# EAGLE design 233_9axis (EAGLE 9.6.2)
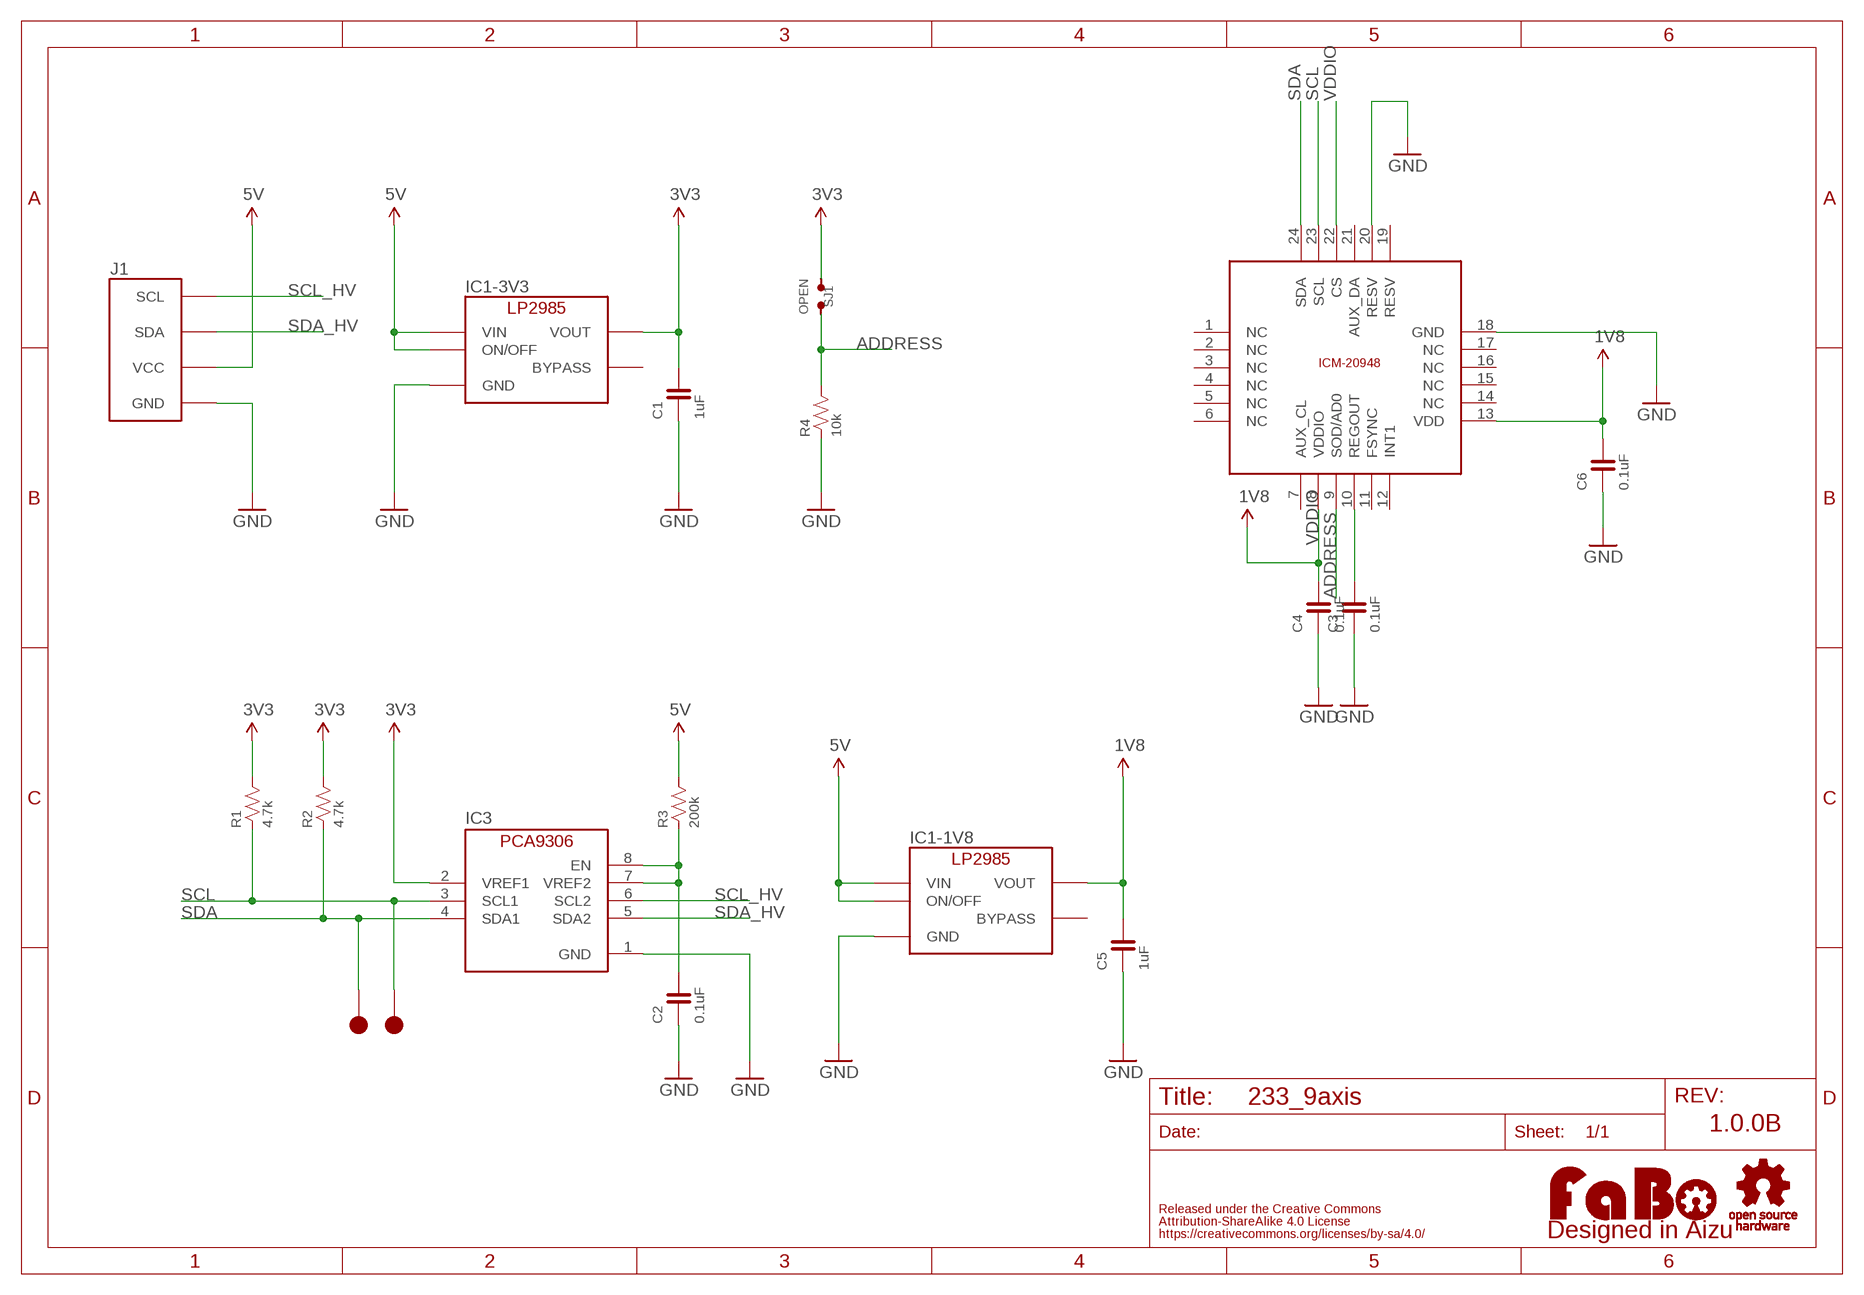
[diagram p0: schematic, sheet 1]

## Parts
C1  1uF  CAPACITOR-0603  [0603]
C2  0.1uF  CAPACITOR-0603  [0603]
C3  0.1uF  CAPACITOR-0603  [0603]
C4  0.1uF  CAPACITOR-0603  [0603]
C5  1uF  CAPACITOR-0603  [0603]
C6  0.1uF  CAPACITOR-0603  [0603]
IC1-1V8  IC1-1V8  LP2985-33DBV  [SOT-23-5]
IC1-3V3  IC1-1V8  LP2985-33DBV  [SOT-23-5]
IC3  PCA9306GM  [XQFN8]
ICM-20948  TDK-ICM20948  [TDK-ICM20948]
J1  FABO_BRICK_I2C  [FABO_BRICK_I2C]
LOGO1  LOGO_FABO-M  [LOGO_FABO_M]
R1  4.7k  RESISTOR-0603  [0603]
R2  4.7k  RESISTOR-0603  [0603]
R3  200k  RESISTOR-0603  [0603]
R4  10k  RESISTOR-0603  [0603]
SJ1  OPEN  SMD-JUMPER-2-OPEN  [SMD-JUMPER-2-OPEN]
TP1  TP-15  [TP-15]
TP2  TP-15  [TP-15]
U$2  LOGO_OSHW-M_BOTTOM  [LOGO_OSHW_M_BOTTOM]

## Nets
1V8: C5.2 C6.2 IC1-1V8.5(VOUT) ICM-20948.13(VDD)
3V3: C1.2 IC1-3V3.5(VOUT) IC3.2(VREF1) R1.2 R2.2 SJ1.1
5V: IC1-1V8.1(VIN) IC1-1V8.3(ON/OFF) IC1-3V3.1(VIN) IC1-3V3.3(ON/OFF) J1.VCC R3.2
ADDRESS: ICM-20948.9(SOD/AD0) R4.2 SJ1.2
GND: C1.1 C2.1 C3.1 C4.1 C5.1 C6.1 IC1-1V8.2(GND) IC1-3V3.2(GND) IC3.1(GND) ICM-20948.18(GND) ICM-20948.20(RESV) J1.GND R4.1
N$1: C2.2 IC3.7(VREF2) IC3.8(EN) R3.1
N$3: C3.2 ICM-20948.10(REGOUT)
SCL: IC3.3(SCL1) ICM-20948.23(SCL) R1.1 TP2.1
SCL_HV: IC3.6(SCL2) J1.SCL
SDA: IC3.4(SDA1) ICM-20948.24(SDA) R2.1 TP1.1
SDA_HV: IC3.5(SDA2) J1.SDA
VDDIO: C4.2 ICM-20948.8(VDDIO) ICM-20948.22(CS) ; supply symbol labelled 1V8
Unconnected: IC1-1V8.4(BYPASS) IC1-3V3.4(BYPASS) ICM-20948.1(NC) ICM-20948.2(NC) ICM-20948.3(NC) ICM-20948.4(NC) ICM-20948.5(NC) ICM-20948.6(NC) ICM-20948.7(AUX_CL) ICM-20948.11(FSYNC) ICM-20948.12(INT1) ICM-20948.14(NC) ICM-20948.15(NC) ICM-20948.16(NC) ICM-20948.17(NC) ICM-20948.19(RESV) ICM-20948.21(AUX_DA)

## Notes on the sheet
- 1.0.0B

## Library data of the parts
C1-C6 = FaBo-Capacitor:CAPACITOR: CAPACITOR
IC1-1V8 IC1-3V3 = FaBo-Supply:LP2985: LP2985
IC3 = FaBo-LevelTranslator:PCA9306
ICM-20948 = FaBo-Axis:TDK-ICM20948
J1 = FaBo-Template:FABO_BRICK_I2C: FaBo Brick I2C
LOGO1 = component:LOGO_FABO
R1-R4 = FaBo-Resistors:RESISTOR: RESISTOR
SJ1 = FaBo-Supply:SMD-JUMPER-2
TP1 TP2 = FaBo-Supply:TP
U$2 = FaBo-etc:LOGO_OSHW

## Board
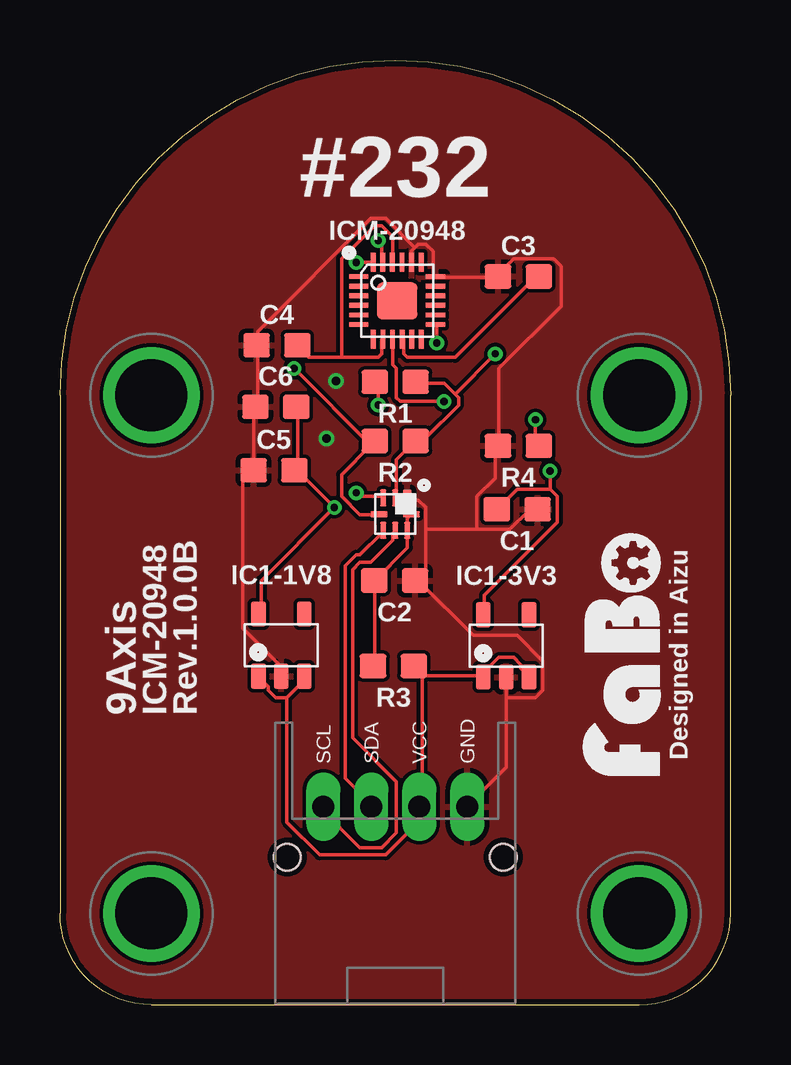
[diagram p1: board, top side]
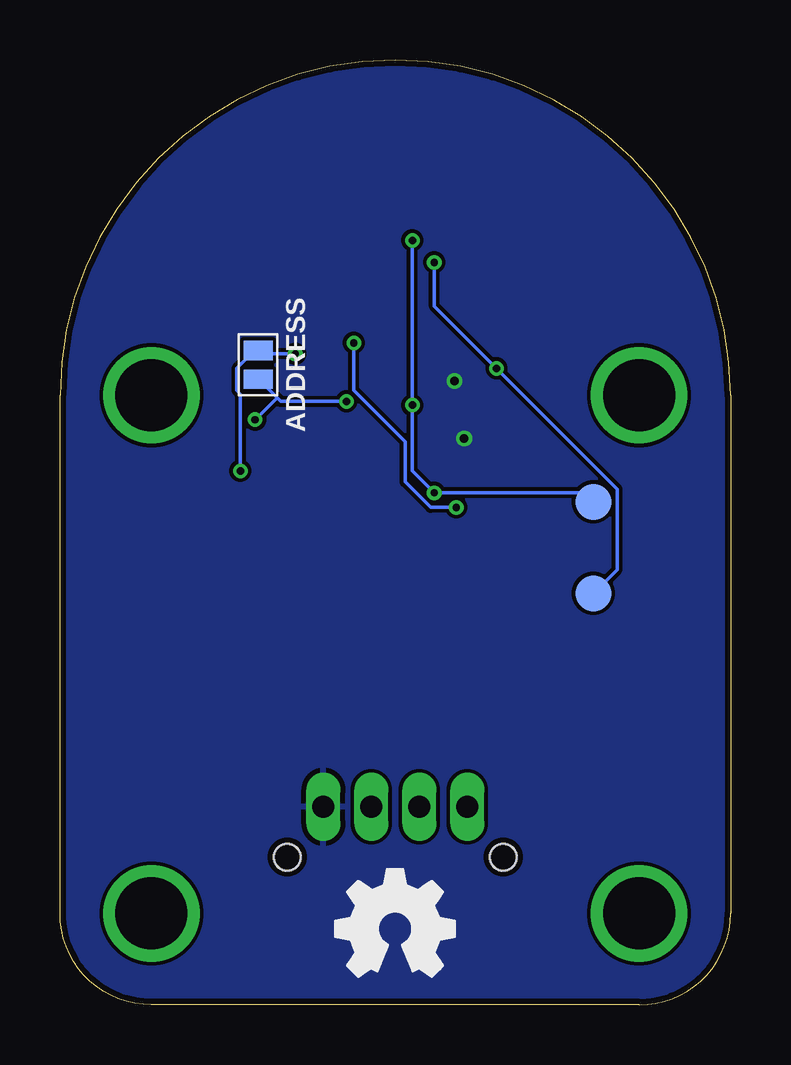
[diagram p2: board, bottom side, seen from below]

Size 27.94 x 39.37 mm. Coordinates in mm from the lower left corner, seen from the top.
Copper layers (1*16): Top 0.035mm / dielectric 1.6mm / Bottom 0.035mm
Design rules "PCBway": minimum track width 6mil, minimum drill 12mil, track to track 6mil, track to pad 6mil, pad to pad 6mil, via to via 6mil, smd to smd 6mil, copper to edge 10mil, drill to drill 10mil, minimum pad ring 10mil, minimum via ring 6mil, stop-mask expansion 2mil, vias tented up to drill 100mil, thermal gap 8mil

### Footprints (pad centres in the part's own frame; a part is rotated, then mirrored left to right if it is on the bottom)
0603 = smd 1.1 x 1: 1 -0.85,0; 2 0.85,0
SOT-23-5 = smd 0.6 x 1.05: 1 -0.95,-1.3; 2 0,-1.3; 3 0.95,-1.3; 4 0.95,1.3; 5 -0.95,1.3
XQFN8 = smd 0.7 x 0.35: 1 -0.675,0.5 | smd 0.7 x 0.25: 2 -0.675,0; 3 -0.675,-0.5; 5 0.675,-0.5; 6 0.675,0; 7 0.675,0.5 | smd 0.25 x 0.7: 4 0,-0.675; 8 0,0.675
TDK-ICM20948 = smd 0.8 x 0.2: 1 -1.6,1.01; 2 -1.6,0.61; 3 -1.6,0.21; 4 -1.6,-0.19; 5 -1.6,-0.59; 6 -1.6,-0.99; 13 1.6,-0.99; 14 1.6,-0.59; 15 1.6,-0.19; 16 1.6,0.21; 17 1.6,0.61; 18 1.6,1.01 | smd 0.2 x 0.8: 7 -0.99,-1.6; 8 -0.59,-1.6; 9 -0.19,-1.6; 10 0.21,-1.6; 11 0.61,-1.6; 12 1.01,-1.6; 19 1,1.6; 20 0.6,1.6; 21 0.2,1.6; 22 -0.2,1.6; 23 -0.6,1.6; 24 -1,1.6 | smd 1.7 x 1.55: 25 0,0
FABO_BRICK_I2C = drill 0.9 pad 1.422 long: GND 3,-10.795; SCL -3,-10.795; SDA -1,-10.795; VCC 1,-10.795 | drill 3 pad 3.81: P$1 -10.16,6.35; P$2 10.16,6.35; P$3 -10.16,-15.24; P$4 10.16,-15.24 | hole 1.1: -4.5,-12.895; 4.5,-12.895
SMD-JUMPER-2-OPEN = smd 0.8 x 1.2: 1 -0.6,0; 2 0.6,0
TP-15 = smd 1.5 x 1.5: 1 0,0

### Placement (x,y rotation side)
C1  19.05,20.65 180 top
C2  13.94,17.68 180 top
C3  19.1,30.35 0 top
C4  9.04,27.48 0 top
C5  8.92,22.28 0 top
C6  8.99,24.92 0 top
IC1-1V8  9.22,14.99 0 top
IC1-3V3  18.59,14.96 0 top
IC3  13.97,20.45 270 top
ICM-20948  14.05,29.34 0 top
J1  13.97,19.05 0 top
LOGO1  25.4,14.61 90 top
R1  13.97,25.96 0 top
R2  13.97,23.5 0 top
R3  13.89,14.12 0 top
R4  19.1,23.29 0 top
SJ1  19.68,26.67 270 bottom
TP1  5.71,17.14 0 bottom
TP2  5.71,20.95 0 bottom
U$2  13.97,3.17 0 top

### Tracks (layer width: path | path; a pad name or v marks a point on that pad's centre or on a via)
1V8  (via drill 0.3)
  Top 0.152: v15.7,27.58 15.7,28.35 ICM-20948.13 | IC1-1V8.5 8.38,16.31 8.38,17.68 v11.43,20.73 9.91,22.25 C5.2 9.91,22.4 9.91,24.84 C6.2
  Bottom 0.152: v15.7,27.58 15.7,25.6 13.56,23.47 13.56,21.79 12.5,20.73 v11.43,20.73
3V3  (via drill 0.3)
  Top 0.152: 20.42,21.49 20.73,21.18 20.73,20.12 17.68,17.07 17.68,16.31 IC1-3V3.5 | 20.42,21.49 19.05,21.49 18.29,20.73 C1.2 | IC3.2 14.02,21.18 14.02,22.71 14.78,23.47 R2.2 14.94,23.62 15.24,23.62 16.61,24.99 16.61,25.3 16.46,25.45 | 16.46,25.45 16,25.91 14.94,25.91 R1.2 | 16.46,25.45 v18.14,27.13 | v20.42,22.25 20.42,21.49
  Bottom 0.152: v18.14,27.13 19.66,27.13 SJ1.1 19.81,27.28 20.57,26.52 20.57,25.6 20.42,25.45 v20.42,22.25
5V
  Top 0.152: 15.09,13.72 17.53,13.72 | 15.09,13.72 14.78,14.02 R3.2 15.09,13.72 | 17.53,13.72 18.29,14.48 18.9,14.48 19.2,14.17 19.2,14.02 19.51,13.72 IC1-3V3.3 | 17.53,13.72 IC1-3V3.1 | 9.45,12.8 8.99,12.8 8.69,13.11 8.69,13.26 8.38,13.56 IC1-1V8.1 | 9.45,12.8 10.21,13.56 IC1-1V8.3 | 9.45,12.8 9.45,7.62 10.82,6.25 13.56,6.25 14.94,7.62 14.94,8.23 J1.VCC 15.09,8.38 15.09,13.72
ADDRESS  (via drill 0.3)
  Top 0.152: v16,25.15 14.17,25.15 14.02,25.3 14.02,26.52 13.87,26.67 ICM-20948.9 | v19.81,24.38 19.81,23.32 R4.2
  Bottom 0.152: v16,25.15 18.75,25.15 18.9,25.3 | 18.9,25.3 19.66,26.06 SJ1.2 | 18.9,25.3 v19.81,24.38
GND  (via drill 0.35)
  Top 0.152: 18.59,12.8 18.59,9.91 17.07,8.38 J1.GND | 18.59,12.8 IC1-3V3.2 | 15.24,19.81 15.24,17.98 14.94,17.68 | 15.24,19.81 15.24,20.73 14.94,21.03 14.48,21.03 IC3.1 | 15.24,19.81 17.37,19.81 | 17.37,19.81 18.75,19.81 19.51,20.57 19.81,20.57 C1.1 | 17.37,19.81 17.37,21.18 18.14,21.95 18.14,23.16 R4.1 18.29,23.32 18.29,26.52 20.88,29.11 20.88,30.79 20.57,31.09 18.9,31.09 18.29,30.48 C3.1 18.14,30.33 15.7,30.33 ICM-20948.18 15.54,30.33 15.54,31.39 15.24,31.7 14.94,31.7 14.78,31.55 | 18.59,12.8 19.81,12.8 20.12,13.11 20.12,14.33 19.05,15.39 17.22,15.39 14.94,17.68 | 14.94,17.68 C2.1 | 14.78,31.55 14.63,31.39 14.63,30.94 ICM-20948.20 | IC1-1V8.2 9.14,13.72 9.14,14.17 7.62,15.7 7.62,21.95 7.92,22.25 C5.1 8.08,22.4 8.08,24.84 C6.1 8.23,24.99 8.23,27.43 C4.1 8.23,27.58 8.23,28.04 12.95,32.77 13.56,32.77 14.78,31.55
  other vias: 11.5,26 11.1,23.6
  pour Top: 0,0 27.94,0 27.94,39.37 0,39.37
  pour Bottom: 0,0 27.94,0 27.94,39.37 0,39.37
N$1
  Top 0.152: IC3.8 14.63,20.42 14.48,20.27 14.48,19.81 IC3.7 14.48,19.66 14.48,19.05 13.11,17.68 | 13.11,17.68 13.11,14.17 R3.1 | 13.11,17.68 C2.2
N$3
  Top 0.152: ICM-20948.10 14.33,27.74 14.33,27.13 14.48,26.98 16.46,26.98 19.81,30.33 C3.2
SCL  (via drill 0.3)
  Top 0.152: v12.34,21.34 12.5,21.18 13.41,21.18 IC3.3 | v13.26,31.85 13.41,31.7 13.41,30.94 ICM-20948.23 | v13.26,24.99 13.26,25.91 R1.1
  Bottom 0.152: TP2.1 6.1,21.34 v12.34,21.34 13.26,22.25 v13.26,24.99 v13.26,31.85
SCL_HV
  Top 0.152: IC3.6 13.87,19.66 13.87,19.36 12.95,18.44 12.5,18.44 12.19,18.14 12.19,11.12 14.02,9.3 14.02,7.16 13.41,6.55 12.5,6.55 10.82,8.23 J1.SCL
SDA  (via drill 0.3)
  Top 0.152: 12.95,23.32 13.11,23.47 R2.1 12.95,23.32 | 12.95,23.32 11.73,22.1 11.73,21.18 12.5,20.42 13.26,20.42 IC3.4 | v12.34,30.94 12.95,30.94 ICM-20948.24 | v9.75,26.52 12.95,23.32
  Bottom 0.152: v12.34,30.94 12.34,29.11 v9.75,26.52 4.72,21.49 4.72,18.14 TP1.1
SDA_HV
  Top 0.152: IC3.5 13.41,19.66 12.5,18.75 12.34,18.75 11.89,18.29 11.89,9.45 12.95,8.38 J1.SDA
VDDIO
  Top 0.152: 11.73,26.98 10.36,26.98 9.91,27.43 C4.2 | 11.73,26.98 13.26,26.98 13.41,27.13 13.41,27.74 ICM-20948.8 | 11.73,26.98 11.73,31.09 13.11,32.46 13.41,32.46 13.87,32 13.87,30.94 ICM-20948.22

### Text on the board
tPlace: #232 | Designed in Aizu | 9Axis | ICM-20948 | Rev.1.0.0B
bPlace: ADDRESS